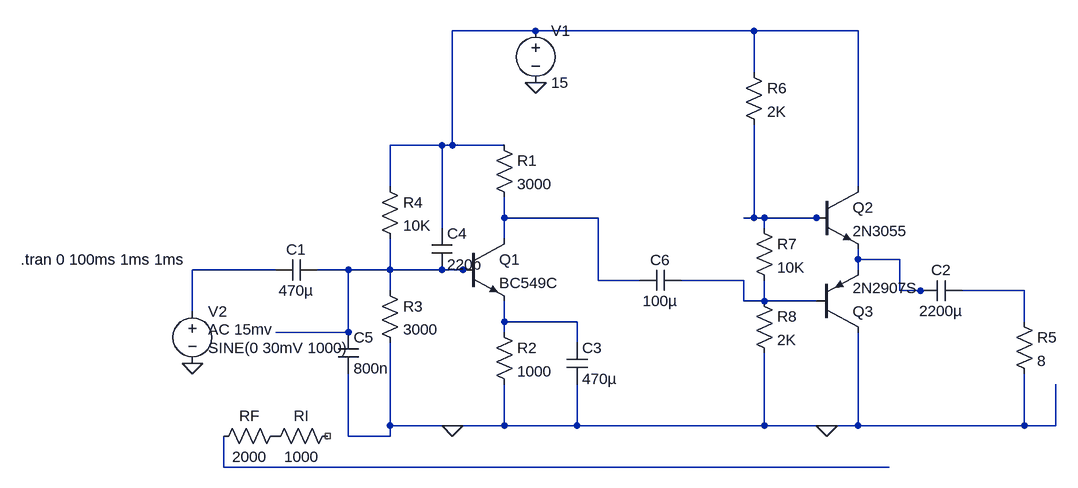
[diagram p0: schematic Push pull.asc]
Push pull.asc, the LTspice schematic file:
Version 4
SHEET 1 1128 680
WIRE 272 -256 144 -256
WIRE 608 -256 272 -256
WIRE 768 -256 608 -256
WIRE 608 -192 608 -256
WIRE 128 -80 48 -80
WIRE 144 -80 144 -256
WIRE 144 -80 128 -80
WIRE 224 -80 144 -80
WIRE 48 -16 48 -80
WIRE 768 -16 768 -256
WIRE 224 32 224 0
WIRE 368 32 224 32
WIRE 608 32 608 -112
WIRE 608 32 592 32
WIRE 624 32 608 32
WIRE 704 32 624 32
WIRE 720 32 704 32
WIRE 128 48 128 -80
WIRE 624 48 624 32
WIRE 224 64 224 32
WIRE 768 96 768 80
WIRE 832 96 768 96
WIRE -128 112 -256 112
WIRE -16 112 -64 112
WIRE 48 112 48 64
WIRE 48 112 -16 112
WIRE 128 112 48 112
WIRE 160 112 128 112
WIRE 176 112 160 112
WIRE 768 112 768 96
WIRE 368 128 368 32
WIRE 432 128 368 128
WIRE 592 128 496 128
WIRE 48 144 48 112
WIRE 832 144 832 96
WIRE 864 144 832 144
WIRE 880 144 864 144
WIRE 1024 144 928 144
WIRE 592 160 592 128
WIRE 624 160 624 128
WIRE 624 160 592 160
WIRE 704 160 624 160
WIRE -256 176 -256 112
WIRE 224 192 224 160
WIRE 336 192 224 192
WIRE 1024 192 1024 144
WIRE -16 208 -16 112
WIRE -16 208 -128 208
WIRE 224 208 224 192
WIRE 336 224 336 192
WIRE 48 352 48 224
WIRE 144 352 48 352
WIRE 224 352 224 288
WIRE 224 352 144 352
WIRE 336 352 336 288
WIRE 336 352 224 352
WIRE 624 352 624 240
WIRE 624 352 336 352
WIRE 720 352 624 352
WIRE 768 352 768 208
WIRE 768 352 720 352
WIRE 1024 352 1024 272
WIRE 1024 352 768 352
WIRE 1072 352 1072 288
WIRE 1072 352 1024 352
WIRE -16 368 -16 272
WIRE 48 368 48 352
WIRE 48 368 -16 368
WIRE -208 416 -208 368
WIRE 816 416 -208 416
FLAG 272 -176 0
FLAG 144 352 0
FLAG -256 256 0
FLAG 720 352 0
SYMBOL npn 160 64 R0
SYMATTR InstName Q1
SYMATTR Value BC549C
SYMBOL res 208 -96 R0
SYMATTR InstName R1
SYMATTR Value 3000
SYMBOL voltage 272 -272 R0
WINDOW 123 0 0 Left 2
WINDOW 39 0 0 Left 2
SYMATTR InstName V1
SYMATTR Value 15
SYMBOL res 32 -32 R0
SYMATTR InstName R4
SYMATTR Value 10K
SYMBOL res 32 128 R0
SYMATTR InstName R3
SYMATTR Value 3000
SYMBOL res 208 192 R0
SYMATTR InstName R2
SYMATTR Value 1000
SYMBOL cap 320 224 R0
SYMATTR InstName C3
SYMATTR Value 470µ
SYMBOL cap -64 96 R90
WINDOW 0 0 32 VBottom 2
WINDOW 3 32 32 VTop 2
SYMATTR InstName C1
SYMATTR Value 470µ
SYMBOL voltage -256 160 R0
WINDOW 123 24 44 Left 2
WINDOW 39 0 0 Left 2
WINDOW 3 24 72 Left 2
SYMATTR Value2 AC 15mv
SYMATTR Value SINE(0 30mV 1000)
SYMATTR InstName V2
SYMBOL res -112 352 R90
WINDOW 0 0 56 VBottom 2
WINDOW 3 32 56 VTop 2
SYMATTR InstName RF
SYMATTR Value 2000
SYMBOL res -32 352 R90
WINDOW 0 0 56 VBottom 2
WINDOW 3 32 56 VTop 2
SYMATTR InstName RI
SYMATTR Value 1000
SYMBOL cap 112 48 R0
SYMATTR InstName C4
SYMATTR Value 220p
SYMBOL cap -32 208 R0
SYMATTR InstName C5
SYMATTR Value 800n
SYMBOL npn2 704 -16 R0
SYMATTR InstName Q2
SYMATTR Value 2N3055
SYMBOL res 1008 176 R0
SYMATTR InstName R5
SYMATTR Value 8
SYMBOL cap 928 128 R90
WINDOW 0 0 32 VBottom 2
WINDOW 3 32 32 VTop 2
SYMATTR InstName C2
SYMATTR Value 2200µ
SYMBOL pnp 704 208 M180
SYMATTR InstName Q3
SYMATTR Value 2N2907S
SYMBOL cap 496 112 R90
WINDOW 0 0 32 VBottom 2
WINDOW 3 32 32 VTop 2
SYMATTR InstName C6
SYMATTR Value 100µ
SYMBOL res 592 -208 R0
SYMATTR InstName R6
SYMATTR Value 2K
SYMBOL res 608 32 R0
SYMATTR InstName R7
SYMATTR Value 10K
SYMBOL res 608 144 R0
SYMATTR InstName R8
SYMATTR Value 2K
TEXT -520 96 Left 2 !.tran 0 100ms 1ms 1ms

The netlist it stands for:
* Push pull.asc
Q1 N002 N006 N009 0 BC549C
R1 N001 N002 3000
V1 N001 0 15
R4 N001 N006 10K
R3 N006 0 3000
R2 N009 0 1000
C3 N009 0 470µ
C1 N006 N005 470µ
V2 N005 0 SINE(0 30mV 1000) AC 15mv
RF P001 N010 2000
RI NC_01 P001 1000
C4 N001 N006 220p
C5 N006 0 800n
Q2 N001 N003 N004 0 2N3055
R5 N008 0 8
C2 N008 N004 2200µ
Q3 0 N007 N004 0 2N2907S
C6 N007 N002 100µ
R6 N001 N003 2K
R7 N003 N007 10K
R8 N007 0 2K
.model NPN NPN
.model PNP PNP
.lib standard.bjt
.tran 0 100ms 1ms 1ms
.backanno
.end